# Altium schematic sheet Sheet2.SchDoc
size A
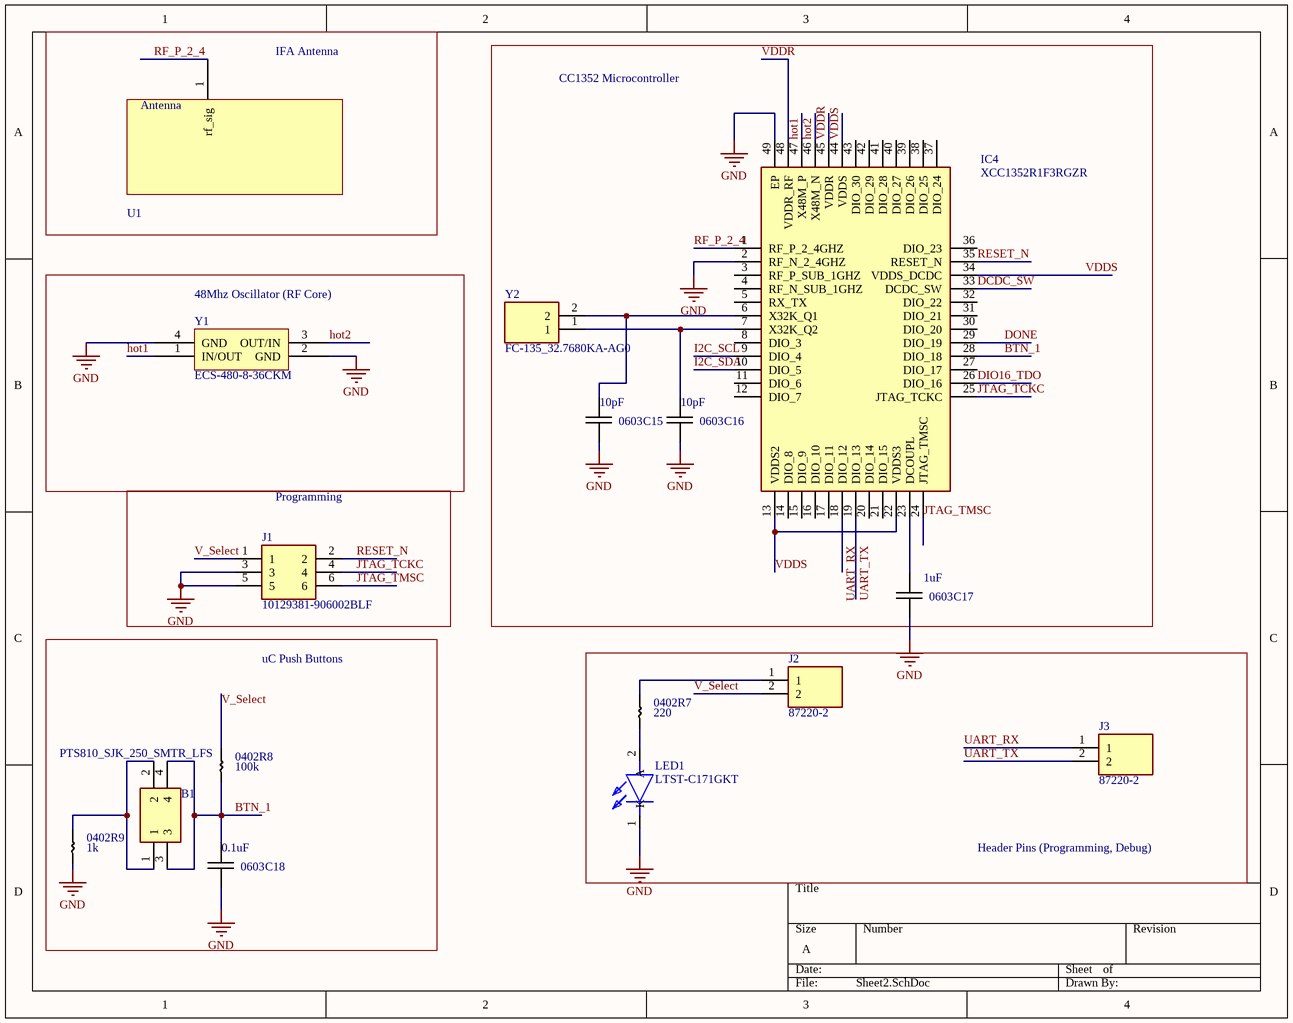
[diagram p0: Sheet2.SchDoc]

## Parts
B1  PTS810_SJK_250_SMTR_LFS  [PTS810SJK250SMTRLFS]
C15  10pF  [0603_SMD]
C16  10pF  [0603_SMD]
C17  1uF  [0603_SMD]
C18  0.1uF  [0603_SMD]
IC4  XCC1352R1F3RGZR  [QFN50P700X700X100-49N-D]
J1  10129381-906002BLF  [HDRV6W67P254_2X3_762X483X858P]
J2  87220-2  [HDRV2W67P0X254_1X2_467X234X1083P]
J3  87220-2  [HDRV2W67P0X254_1X2_467X234X1083P]
LED1  LTST-C171GKT  [LEDC2012X90N]
R7  220  [0402_SMD]
R8  100k  [0402_SMD]
R9  1k  [0402_SMD]
U1  RF_ANTENNA_2  [RF_TRACE_ANTENNA_2]  (value not drawn)
Y1  ECS-480-8-36CKM  [ECS-480-8-36CKM]
Y2  FC-135_32.7680KA-AG0  [FC135327680KAAG0]

## Blocks framed on the sheet
IFA Antenna: U1
CC1352 Microcontroller: C15-C17 IC4 Y2
48Mhz Oscillator (RF Core): Y1
Programming: J1
uC Push Buttons: B1 C18 R8 R9
Header Pins (Programming, Debug): J2 J3 LED1 R7

## Nets
GND: C15.1 C16.1 C17.1 C18.1 IC4.2(RF_N_2_4GHZ) IC4.49(EP) J1.3 J1.5 LED1.1(K) R9.2 Y1.2(GND) Y1.4(GND)
BTN_1: B1.3 B1.4 C18.2 IC4.28(DIO_18) R8.2
DCDC_SW: IC4.33(DCDC_SW)
DIO16_TDO: IC4.26(DIO_16)
DONE: IC4.29(DIO_19)
hot1: IC4.47(X48M_P) Y1.1(IN/OUT)
hot2: IC4.46(X48M_N) Y1.3(OUT/IN)
I2C_SCL: IC4.9(DIO_4)
I2C_SDA: IC4.10(DIO_5)
JTAG_TCKC: IC4.25(JTAG_TCKC) J1.4
JTAG_TMSC: IC4.24(JTAG_TMSC) J1.6
RESET_N: IC4.35(RESET_N) J1.2
RF_P_2_4: IC4.1(RF_P_2_4GHZ) U1.1(rf_sig)
UART_RX: IC4.18(DIO_12) J3.1
UART_TX: IC4.19(DIO_13) J3.2
V_Select: J1.1 J2.2 R8.1
VDDR: IC4.45(VDDR) IC4.48(VDDR_RF)
VDDS: IC4.13(VDDS2) IC4.22(VDDS3) IC4.34(VDDS_DCDC) IC4.44(VDDS)
NetB1_1: B1.1 B1.2 R9.1
NetC15_2: C15.2 IC4.6(X32K_Q1) Y2.2
NetC16_2: C16.2 IC4.7(X32K_Q2) Y2.1
NetC17_2: C17.2 IC4.23(DCOUPL)
NetJ2_1: J2.1 R7.1
NetLED1_2: LED1.2(A) R7.2

Not connected (* = marked no-connect by the designer): IC4 3(RF_P_SUB_1GHZ) 4(RF_N_SUB_1GHZ) 5(RX_TX) 8(DIO_3) 11(DIO_6) 12(DIO_7) 14(DIO_8) 15(DIO_9) 16(DIO_10) 17(DIO_11) 20(DIO_14) 21(DIO_15) 27(DIO_17) 30(DIO_20) 31(DIO_21) 32(DIO_22) 36(DIO_23) 37(DIO_24) 38(DIO_25) 39(DIO_26) 40(DIO_27) 41(DIO_28) 42(DIO_29) 43(DIO_30)

## Notes on the sheet
- (in symbol C_0603) 0603
- (in symbol R_0402) 0402
- (in symbol RF_ANTENNA_2) Antenna

## Library data of the parts
B1 = PTS810_SJK_250_SMTR_LFS: Crystal or Oscillator; Manufacturer_Name: C & K COMPONENTS; Manufacturer_Part_Number: PTS810 SJK 250 SMTR LFS; Datasheet Link: https://www.ckswitches.com/media/1476/pts810.pdf; Height: 2mm; Mouser Part Number: 611-PTS810SJK250SMTR; Mouser Price/Stock: https://www.mouser.com/Search/Refine.aspx?Keyword=611-PTS810SJK250SMTR
C15-C18 = C_0603
IC4 = XCC1352R1F3RGZR: Integrated Circuit; Manufacturer_Name: Texas Instruments; Datasheet Link: http://www.ti.com/lit/gpn/cc1352r; Height: 1mm; Manufacturer_Part_Number: XCC1352R1F3RGZR
J1 = 10129381-906002BLF: Connector; Manufacturer_Name: Amphenol; Datasheet Link: https://componentsearchengine.com/Datasheets/1/10129381-906002BLF.pdf; Height: 8.58mm; Manufacturer_Part_Number: 10129381-906002BLF; Mouser Part Number: 649-1012938190602BLF; Mouser Price/Stock: https://www.mouser.com/Search/Refine.aspx?Keyword=649-1012938190602BLF
J2 J3 = 87220-2: Connector; Manufacturer_Name: TE Connectivity; Allied_Number: 70082840; Datasheet Link: https://www.te.com/commerce/DocumentDelivery/DDEController?Action=showdoc&DocId=Customer+Drawing%7F87220%7FK3%7Fpdf%7FEnglish%7FENG_CD_87220_K3.pdf%7F87220-2; Height: 10.83mm; Manufacturer_Part_Number: 87220-2; Mouser Part Number: 571-872202; Mouser Price/Stock: https://www.mouser.com/Search/Refine.aspx?Keyword=571-872202; RS Part Number: 7202418P; RS Price/Stock: http://uk.rs-online.com/web/p/products/7202418P; Allied Price/Stock: https://www.alliedelec.com/teconnectivity-87220-2/70082840/
LED1 = LTST-C171GKT: LED; Manufacturer_Name: Lite-On; Datasheet Link: https://media.digikey.com/pdf/Data%20Sheets/Lite-On%20PDFs/LTST-C171GKT.pdf; Height: 0.9mm; Manufacturer_Part_Number: LTST-C171GKT; Mouser Part Number: 859-LTST-C171GKT; Mouser Price/Stock: https://www.mouser.com/Search/Refine.aspx?Keyword=859-LTST-C171GKT; RS Part Number: 6920935P; RS Price/Stock: http://uk.rs-online.com/web/p/products/6920935P
R7-R9 = R_0402
Y2 = FC-135_32.7680KA-AG0: Crystal or Oscillator; Manufacturer_Name: Epson Timing; Manufacturer_Part_Number: FC-135 32.7680KA-AG0; Datasheet Link: https://support.epson.biz/td/api/doc_check.php?dl=brief_FC-135&lang=en/.pdf; Height: 0mm; Mouser Part Number: 732-FC135-32.76KAAG0; Mouser Price/Stock: https://www.mouser.com/Search/Refine.aspx?Keyword=732-FC135-32.76KAAG0